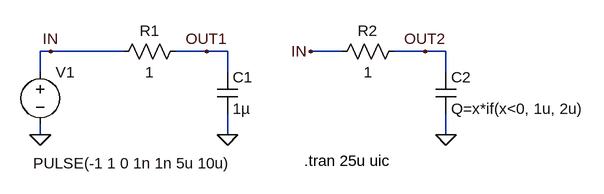
[diagram p0: schematic Fig_2-89_Cap-Q-if.asc]
Fig_2-89_Cap-Q-if.asc, the LTspice schematic file:
Version 4
SHEET 1 916 680
WIRE 32 112 16 112
WIRE 144 112 32 112
WIRE 272 112 224 112
WIRE 304 112 272 112
WIRE 480 112 432 112
WIRE 608 112 560 112
WIRE 640 112 608 112
WIRE 16 144 16 112
WIRE 304 144 304 112
WIRE 640 144 640 112
WIRE 16 240 16 224
WIRE 304 240 304 208
WIRE 640 240 640 208
FLAG 16 240 0
FLAG 304 240 0
FLAG 32 112 IN
FLAG 272 112 OUT1
FLAG 640 240 0
FLAG 608 112 OUT2
FLAG 432 112 IN
SYMBOL voltage 16 128 R0
WINDOW 3 -11 156 Left 2
WINDOW 123 0 0 Left 0
WINDOW 39 0 0 Left 0
SYMATTR InstName V1
SYMATTR Value PULSE(-1 1 0 1n 1n 5u 10u)
SYMBOL res 128 128 R270
WINDOW 0 32 56 VTop 2
WINDOW 3 0 56 VBottom 2
SYMATTR InstName R1
SYMATTR Value 1
SYMBOL cap 288 144 R0
SYMATTR InstName C1
SYMATTR Value 1µ
SYMBOL res 464 128 R270
WINDOW 0 32 56 VTop 2
WINDOW 3 0 56 VBottom 2
SYMATTR InstName R2
SYMATTR Value 1
SYMBOL cap 624 144 R0
SYMATTR InstName C2
SYMATTR Value Q=x*if(x<0, 1u, 2u)
TEXT 422 280 Left 2 !.tran 25u uic

The netlist it stands for:
* Fig_2-89_Cap-Q-if.asc
V1 IN 0 PULSE(-1 1 0 1n 1n 5u 10u)
R1 IN OUT1 1
C1 OUT1 0 1µ
R2 IN OUT2 1
C2 OUT2 0 Q=x*if(x<0, 1u, 2u)
.tran 25u uic
.backanno
.end